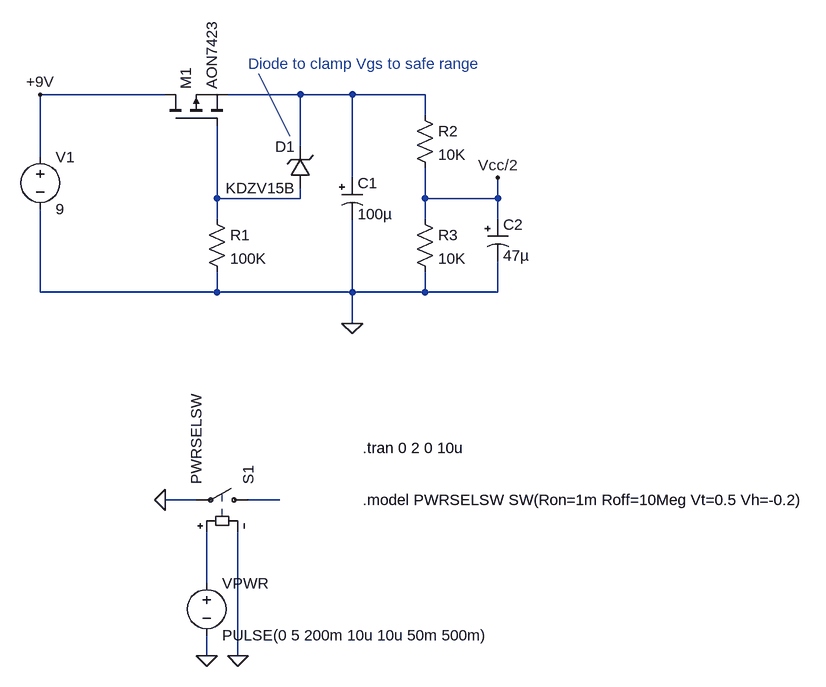
[diagram p0: schematic Pedal_Power_Circuit.asc]
Pedal_Power_Circuit.asc, the LTspice schematic file:
Version 4
SHEET 1 1132 820
WIRE 32 -64 -160 -64
WIRE 240 -64 128 -64
WIRE 320 -64 240 -64
WIRE 432 -64 320 -64
WIRE 432 -32 432 -64
WIRE 240 16 240 -64
WIRE -160 32 -160 -64
WIRE 320 64 320 -64
WIRE 112 96 112 -16
WIRE 240 96 240 80
WIRE 240 96 112 96
WIRE 432 96 432 48
WIRE 544 96 544 64
WIRE 544 96 432 96
WIRE 112 128 112 96
WIRE 432 128 432 96
WIRE 544 128 544 96
WIRE -160 240 -160 112
WIRE 112 240 112 208
WIRE 112 240 -160 240
WIRE 320 240 320 128
WIRE 320 240 112 240
WIRE 432 240 432 208
WIRE 432 240 320 240
WIRE 544 240 544 192
WIRE 544 240 432 240
WIRE 320 288 320 240
WIRE 80 560 32 560
WIRE 208 560 160 560
WIRE 96 688 96 608
WIRE 96 800 96 768
WIRE 144 800 144 608
FLAG 320 288 0
FLAG 544 64 Vcc/2
FLAG -160 -64 +9V
FLAG 96 800 0
FLAG 144 800 0
FLAG 32 560 0
SYMBOL polcap 304 64 R0
WINDOW 3 24 56 Left 2
SYMATTR InstName C1
SYMATTR Value 100µ
SYMATTR Description Capacitor
SYMATTR Type cap
SYMATTR SpiceLine V=16 Irms=0 Rser=0.1 Lser=0 mfg="AVX" pn="TPSE107M016R0100" type="Tantalum"
SYMBOL res 416 -48 R0
SYMATTR InstName R2
SYMATTR Value 10K
SYMBOL res 416 112 R0
SYMATTR InstName R3
SYMATTR Value 10K
SYMBOL polcap 528 128 R0
WINDOW 3 24 56 Left 2
SYMATTR InstName C2
SYMATTR Value 47µ
SYMATTR Description Capacitor
SYMATTR Type cap
SYMATTR SpiceLine V=10 Irms=0 Rser=1.2 Lser=0 mfg="AVX" pn="TAJD476K010" type="Tantalum"
SYMBOL voltage -160 16 R0
WINDOW 123 0 0 Left 0
WINDOW 39 0 0 Left 0
SYMATTR InstName V1
SYMATTR Value 9
SYMBOL sw 176 560 M270
SYMATTR InstName S1
SYMATTR Value PWRSELSW
SYMBOL voltage 96 672 R0
WINDOW 123 0 0 Left 0
WINDOW 39 0 0 Left 0
SYMATTR InstName VPWR
SYMATTR Value PULSE(0 5 200m 10u 10u 50m 500m)
SYMBOL pmos 32 -16 R270
SYMATTR InstName M1
SYMATTR Value AON7423
SYMBOL zener 256 80 R180
WINDOW 0 24 64 Left 2
WINDOW 3 24 0 Left 2
SYMATTR InstName D1
SYMATTR Value KDZV15B
SYMATTR Description Diode
SYMATTR Type diode
SYMBOL res 96 112 R0
SYMATTR InstName R1
SYMATTR Value 100K
TEXT 336 560 Left 2 !.model PWRSELSW SW(Ron=1m Roff=10Meg Vt=0.5 Vh=-0.2)
TEXT 336 480 Left 2 !.tran 0 2 0 10u
TEXT 160 -112 Left 2 ;Diode to clamp Vgs to safe range
LINE Normal 224 0 176 -96

The netlist it stands for:
* Pedal_Power_Circuit.asc
C1 N001 0 100µ V=16 Irms=0 Rser=0.1 Lser=0 mfg="AVX" pn="TPSE107M016R0100" type="Tantalum"
R2 N001 Vcc/2 10K
R3 Vcc/2 0 10K
C2 Vcc/2 0 47µ V=10 Irms=0 Rser=1.2 Lser=0 mfg="AVX" pn="TAJD476K010" type="Tantalum"
V1 +9V 0 9
S1 N003 0 N004 0 PWRSELSW
VPWR N004 0 PULSE(0 5 200m 10u 10u 50m 500m)
M1 +9V N002 N001 N001 AON7423
D1 N002 N001 KDZV15B
R1 N002 0 100K
.model D D
.lib standard.dio
.model NMOS NMOS
.model PMOS PMOS
.lib standard.mos
.model PWRSELSW SW(Ron=1m Roff=10Meg Vt=0.5 Vh=-0.2)
.tran 0 2 0 10u
* Diode to clamp Vgs to safe range
.backanno
.end